# Altium schematic sheet ZynqPower.SchDoc: =TITLE
size A3; DocumentNumber: 3; SheetNumber: 3; SheetTotal: 11
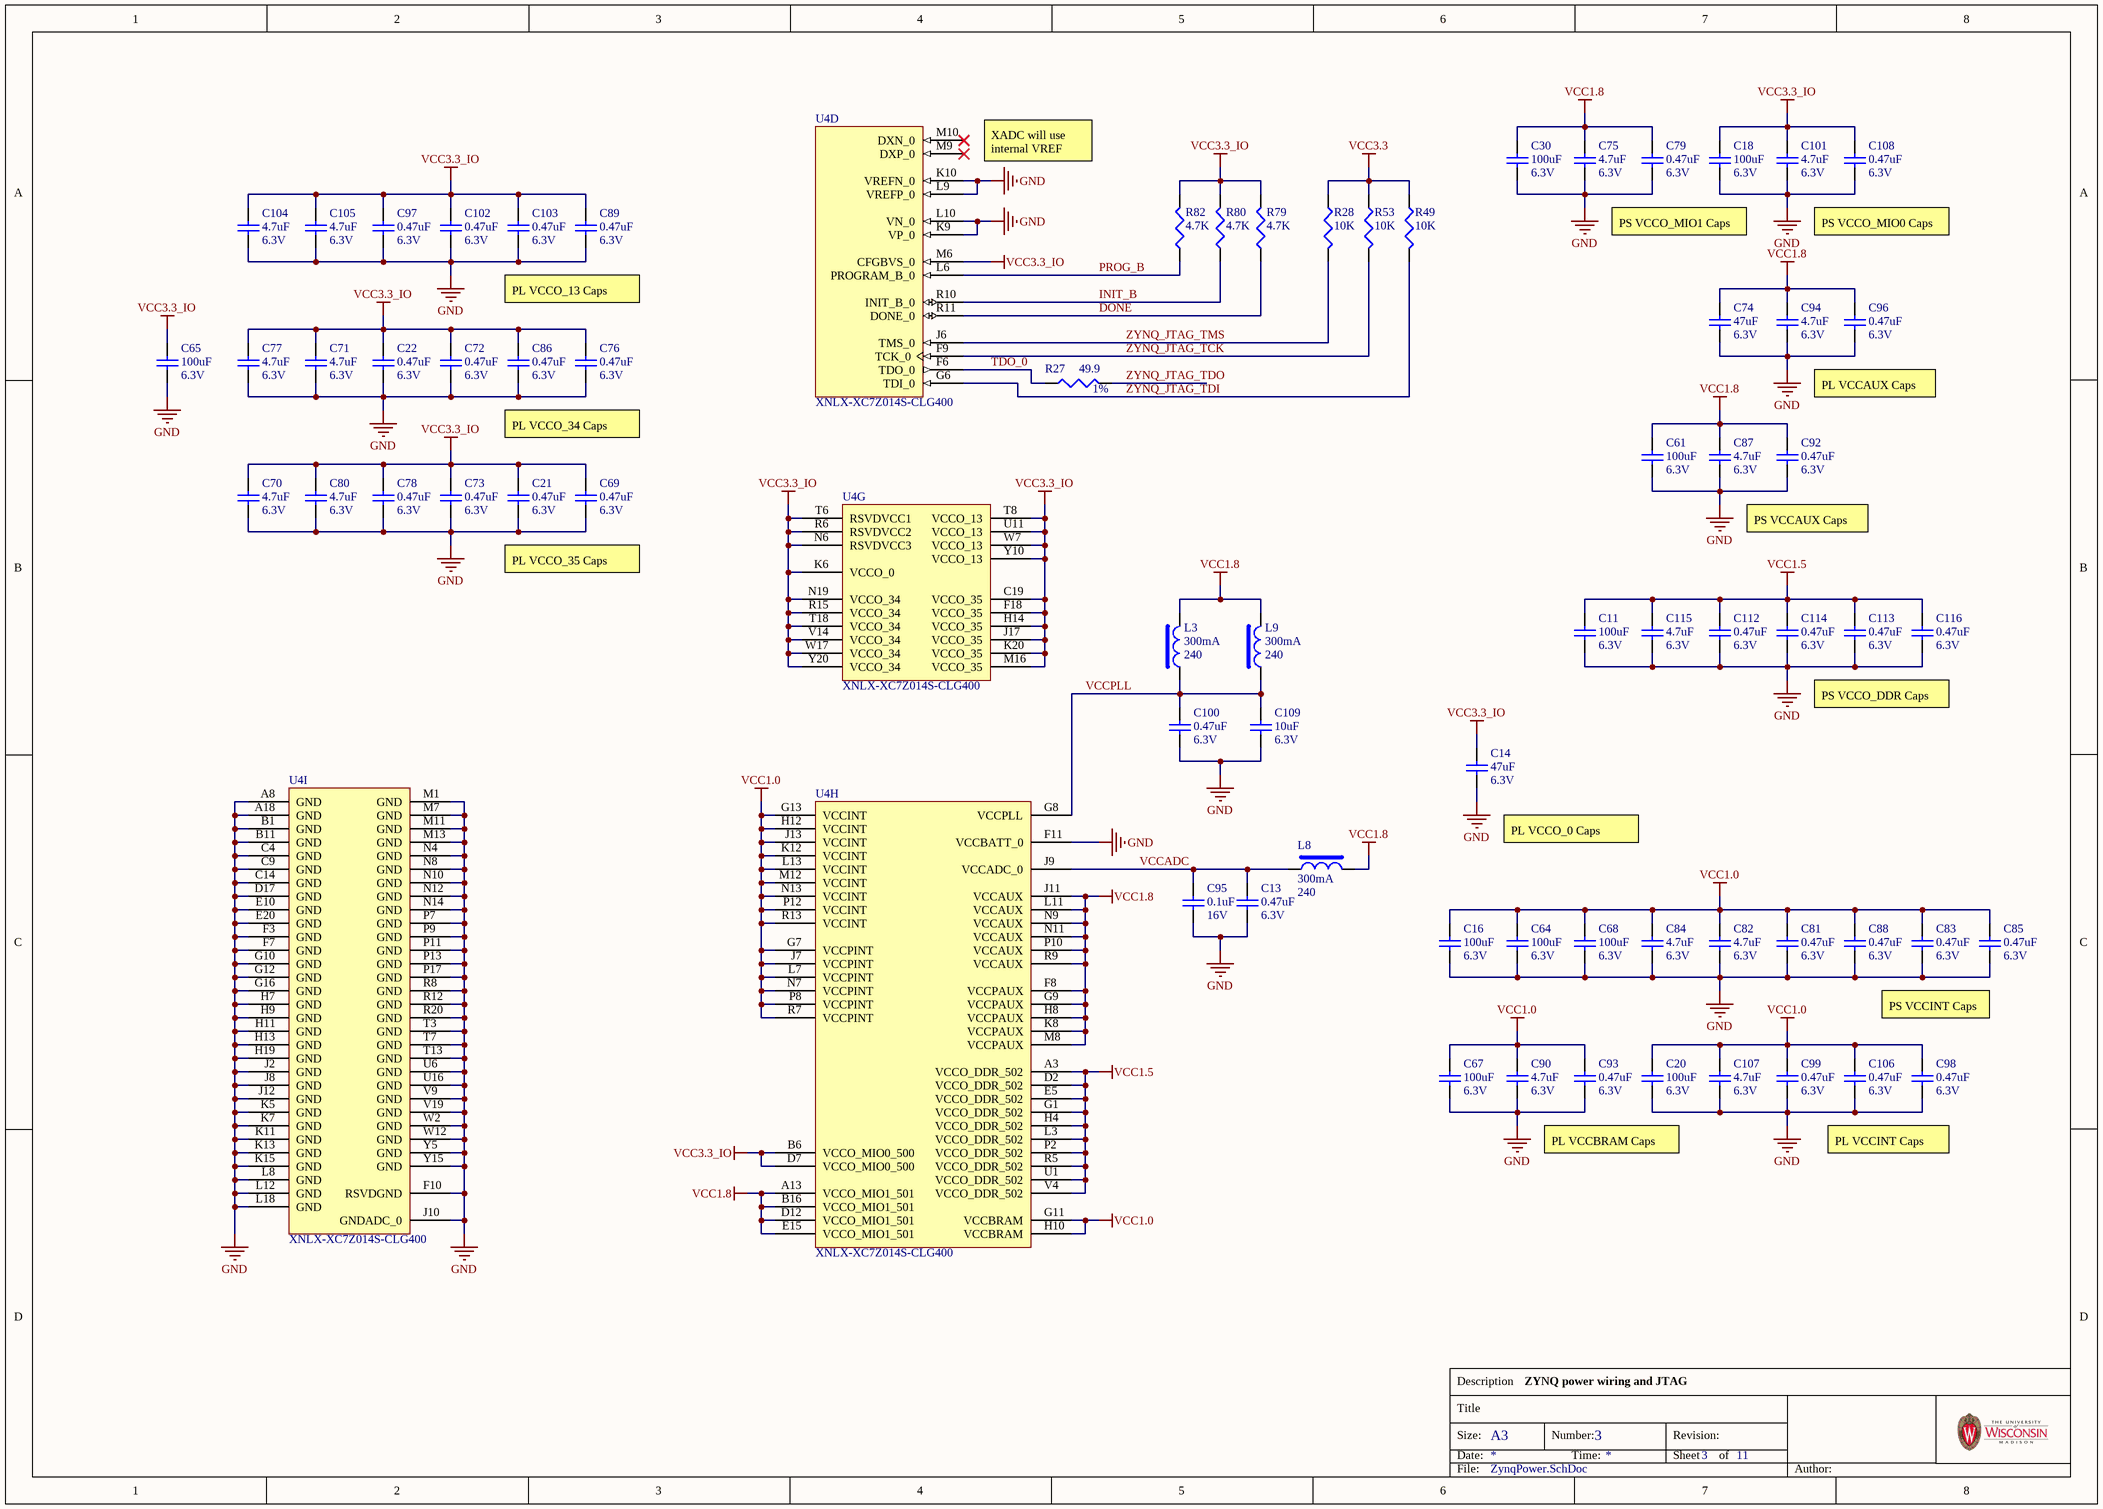
[diagram p0: ZynqPower.SchDoc]

## Parts
C11  value 100uF  Rating: 6.3V  [C1210_IPC_H]  (hidden comment: ?)
C13  value 0.47uF  Rating: 6.3V  [C0402_IPC_H]  (hidden comment: ?)
C14  value 47uF  Rating: 6.3V  [C0805_M]  (hidden comment: ?)
C16  value 100uF  Rating: 6.3V  [C1210_IPC_H]  (hidden comment: ?)
C18  value 100uF  Rating: 6.3V  [C1210_IPC_H]  (hidden comment: ?)
C20  value 100uF  Rating: 6.3V  [C1210_IPC_H]  (hidden comment: ?)
C21  value 0.47uF  Rating: 6.3V  [C0402_IPC_H]  (hidden comment: ?)
C22  value 0.47uF  Rating: 6.3V  [C0402_IPC_H]  (hidden comment: ?)
C30  value 100uF  Rating: 6.3V  [C1210_IPC_H]  (hidden comment: ?)
C61  value 100uF  Rating: 6.3V  [C1210_IPC_H]  (hidden comment: ?)
C64  value 100uF  Rating: 6.3V  [C1210_IPC_H]  (hidden comment: ?)
C65  value 100uF  Rating: 6.3V  [C1210_IPC_H]  (hidden comment: ?)
C67  value 100uF  Rating: 6.3V  [C1210_IPC_H]  (hidden comment: ?)
C68  value 100uF  Rating: 6.3V  [C1210_IPC_H]  (hidden comment: ?)
C69  value 0.47uF  Rating: 6.3V  [C0402_IPC_H]  (hidden comment: ?)
C70  value 4.7uF  Rating: 6.3V  [C0402_IPC_H]  (hidden comment: ?)
C71  value 4.7uF  Rating: 6.3V  [C0402_IPC_H]  (hidden comment: ?)
C72  value 0.47uF  Rating: 6.3V  [C0402_IPC_H]  (hidden comment: ?)
C73  value 0.47uF  Rating: 6.3V  [C0402_IPC_H]  (hidden comment: ?)
C74  value 47uF  Rating: 6.3V  [C0805_M]  (hidden comment: ?)
C75  value 4.7uF  Rating: 6.3V  [C0402_IPC_H]  (hidden comment: ?)
C76  value 0.47uF  Rating: 6.3V  [C0402_IPC_H]  (hidden comment: ?)
C77  value 4.7uF  Rating: 6.3V  [C0402_IPC_H]  (hidden comment: ?)
C78  value 0.47uF  Rating: 6.3V  [C0402_IPC_H]  (hidden comment: ?)
C79  value 0.47uF  Rating: 6.3V  [C0402_IPC_H]  (hidden comment: ?)
C80  value 4.7uF  Rating: 6.3V  [C0402_IPC_H]  (hidden comment: ?)
C81  value 0.47uF  Rating: 6.3V  [C0402_IPC_H]  (hidden comment: ?)
C82  value 4.7uF  Rating: 6.3V  [C0402_IPC_H]  (hidden comment: ?)
C83  value 0.47uF  Rating: 6.3V  [C0402_IPC_H]  (hidden comment: ?)
C84  value 4.7uF  Rating: 6.3V  [C0402_IPC_H]  (hidden comment: ?)
C85  value 0.47uF  Rating: 6.3V  [C0402_IPC_H]  (hidden comment: ?)
C86  value 0.47uF  Rating: 6.3V  [C0402_IPC_H]  (hidden comment: ?)
C87  value 4.7uF  Rating: 6.3V  [C0402_IPC_H]  (hidden comment: ?)
C88  value 0.47uF  Rating: 6.3V  [C0402_IPC_H]  (hidden comment: ?)
C89  value 0.47uF  Rating: 6.3V  [C0402_IPC_H]  (hidden comment: ?)
C90  value 4.7uF  Rating: 6.3V  [C0402_IPC_H]  (hidden comment: ?)
C92  value 0.47uF  Rating: 6.3V  [C0402_IPC_H]  (hidden comment: ?)
C93  value 0.47uF  Rating: 6.3V  [C0402_IPC_H]  (hidden comment: ?)
C94  value 4.7uF  Rating: 6.3V  [C0402_IPC_H]  (hidden comment: ?)
C95  value 0.1uF  Rating: 16V  [C0402_IPC_H]  (hidden comment: ?)
C96  value 0.47uF  Rating: 6.3V  [C0402_IPC_H]  (hidden comment: ?)
C97  value 0.47uF  Rating: 6.3V  [C0402_IPC_H]  (hidden comment: ?)
C98  value 0.47uF  Rating: 6.3V  [C0402_IPC_H]  (hidden comment: ?)
C99  value 0.47uF  Rating: 6.3V  [C0402_IPC_H]  (hidden comment: ?)
C100  value 0.47uF  Rating: 6.3V  [C0402_IPC_H]  (hidden comment: ?)
C101  value 4.7uF  Rating: 6.3V  [C0402_IPC_H]  (hidden comment: ?)
C102  value 0.47uF  Rating: 6.3V  [C0402_IPC_H]  (hidden comment: ?)
C103  value 0.47uF  Rating: 6.3V  [C0402_IPC_H]  (hidden comment: ?)
C104  value 4.7uF  Rating: 6.3V  [C0402_IPC_H]  (hidden comment: ?)
C105  value 4.7uF  Rating: 6.3V  [C0402_IPC_H]  (hidden comment: ?)
C106  value 0.47uF  Rating: 6.3V  [C0402_IPC_H]  (hidden comment: ?)
C107  value 4.7uF  Rating: 6.3V  [C0402_IPC_H]  (hidden comment: ?)
C108  value 0.47uF  Rating: 6.3V  [C0402_IPC_H]  (hidden comment: ?)
C109  value 10uF  Rating: 6.3V  [C0402_IPC_H]  (hidden comment: ?)
C112  value 0.47uF  Rating: 6.3V  [C0402_IPC_H]  (hidden comment: ?)
C113  value 0.47uF  Rating: 6.3V  [C0402_IPC_H]  (hidden comment: ?)
C114  value 0.47uF  Rating: 6.3V  [C0402_IPC_H]  (hidden comment: ?)
C115  value 4.7uF  Rating: 6.3V  [C0402_IPC_H]  (hidden comment: ?)
C116  value 0.47uF  Rating: 6.3V  [C0402_IPC_H]  (hidden comment: ?)
L3  value 240  Rated Current: 300mA  [L0402_H]  (hidden comment: BK1005HM241-T)
L8  value 240  Rated Current: 300mA  [L0402_H]  (hidden comment: BK1005HM241-T)
L9  value 240  Rated Current: 300mA  [L0402_H]  (hidden comment: BK1005HM241-T)
R27  value 49.9  Tolerance: 1%  [R0402_IPC_H]  (hidden comment: ?)
R28  value 10K  [R0402_IPC_H]  (hidden comment: ?)
R49  value 10K  [R0402_IPC_H]  (hidden comment: ?)
R53  value 10K  [R0402_IPC_H]  (hidden comment: ?)
R79  value 4.7K  [R0402_IPC_H]  (hidden comment: ?)
R80  value 4.7K  [R0402_IPC_H]  (hidden comment: ?)
R82  value 4.7K  [R0402_IPC_H]  (hidden comment: ?)
U4  XNLX-XC7Z014S-CLG400  [CLG400]  (parts D,G,H,I of 9)

## Nets
GND: C11.2 C13.2 C14.2 C16.2 C18.2 C20.2 C21.2 C22.2 C30.2 C61.2 C64.2 C65.2 C67.2 C68.2 C69.2 C70.2 C71.2 C72.2 C73.2 C74.2 C75.2 C76.2 C77.2 C78.2 C79.2 C80.2 C81.2 C82.2 C83.2 C84.2 C85.2 C86.2 C87.2 C88.2 C89.2 C90.2 C92.2 C93.2 C94.2 C95.2 C96.2 C97.2 C98.2 C99.2 C100.2 C101.2 C102.2 C103.2 C104.2 C105.2 C106.2 C107.2 C108.2 C109.2 C112.2 C113.2 C114.2 C115.2 C116.2 U4.A8(GND) U4.A18(GND) U4.B1(GND) U4.B11(GND) U4.C4(GND) U4.C9(GND) U4.C14(GND) U4.D17(GND) U4.E10(GND) U4.E20(GND) U4.F3(GND) U4.F7(GND) U4.F10(RSVDGND) U4.F11(VCCBATT_0) U4.G10(GND) U4.G12(GND) U4.G16(GND) U4.H7(GND) U4.H9(GND) U4.H11(GND) U4.H13(GND) U4.H19(GND) U4.J2(GND) U4.J8(GND) U4.J10(GNDADC_0) U4.J12(GND) U4.K5(GND) U4.K7(GND) U4.K9(VP_0) U4.K10(VREFN_0) U4.K11(GND) U4.K13(GND) U4.K15(GND) U4.L8(GND) U4.L9(VREFP_0) U4.L10(VN_0) U4.L12(GND) U4.L18(GND) U4.M1(GND) U4.M7(GND) U4.M11(GND) U4.M13(GND) U4.N4(GND) U4.N8(GND) U4.N10(GND) U4.N12(GND) U4.N14(GND) U4.P7(GND) U4.P9(GND) U4.P11(GND) U4.P13(GND) U4.P17(GND) U4.R8(GND) U4.R12(GND) U4.R20(GND) U4.T3(GND) U4.T7(GND) U4.T13(GND) U4.U6(GND) U4.U16(GND) U4.V9(GND) U4.V19(GND) U4.W2(GND) U4.W12(GND) U4.Y5(GND) U4.Y15(GND)
VCC1.0: C16.1 C20.1 C64.1 C67.1 C68.1 C81.1 C82.1 C83.1 C84.1 C85.1 C88.1 C90.1 C93.1 C98.1 C99.1 C106.1 C107.1 U4.G7(VCCPINT) U4.G11(VCCBRAM) U4.G13(VCCINT) U4.H10(VCCBRAM) U4.H12(VCCINT) U4.J7(VCCPINT) U4.J13(VCCINT) U4.K12(VCCINT) U4.L7(VCCPINT) U4.L13(VCCINT) U4.M12(VCCINT) U4.N7(VCCPINT) U4.N13(VCCINT) U4.P8(VCCPINT) U4.P12(VCCINT) U4.R7(VCCPINT) U4.R13(VCCINT)
VCC1.5: C11.1 C112.1 C113.1 C114.1 C115.1 C116.1 U4.A3(VCCO_DDR_502) U4.D2(VCCO_DDR_502) U4.E5(VCCO_DDR_502) U4.G1(VCCO_DDR_502) U4.H4(VCCO_DDR_502) U4.L3(VCCO_DDR_502) U4.P2(VCCO_DDR_502) U4.R5(VCCO_DDR_502) U4.U1(VCCO_DDR_502) U4.V4(VCCO_DDR_502)
VCC1.8: C30.1 C61.1 C74.1 C75.1 C79.1 C87.1 C92.1 C94.1 C96.1 L3.2 L8.2 L9.2 U4.A13(VCCO_MIO1_501) U4.B16(VCCO_MIO1_501) U4.D12(VCCO_MIO1_501) U4.E15(VCCO_MIO1_501) U4.F8(VCCPAUX) U4.G9(VCCPAUX) U4.H8(VCCPAUX) U4.J11(VCCAUX) U4.K8(VCCPAUX) U4.L11(VCCAUX) U4.M8(VCCPAUX) U4.N9(VCCAUX) U4.N11(VCCAUX) U4.P10(VCCAUX) U4.R9(VCCAUX)
VCC3.3: R28.1 R49.1 R53.1
VCC3.3_IO: C14.1 C18.1 C21.1 C22.1 C65.1 C69.1 C70.1 C71.1 C72.1 C73.1 C76.1 C77.1 C78.1 C80.1 C86.1 C89.1 C97.1 C101.1 C102.1 C103.1 C104.1 C105.1 C108.1 R79.2 R80.2 R82.2 U4.B6(VCCO_MIO0_500) U4.C19(VCCO_35) U4.D7(VCCO_MIO0_500) U4.F18(VCCO_35) U4.H14(VCCO_35) U4.J17(VCCO_35) U4.K6(VCCO_0) U4.K20(VCCO_35) U4.M6(CFGBVS_0) U4.M16(VCCO_35) U4.N6(RSVDVCC3) U4.N19(VCCO_34) U4.R6(RSVDVCC2) U4.R15(VCCO_34) U4.T6(RSVDVCC1) U4.T8(VCCO_13) U4.T18(VCCO_34) U4.U11(VCCO_13) U4.V14(VCCO_34) U4.W7(VCCO_13) U4.W17(VCCO_34) U4.Y10(VCCO_13) U4.Y20(VCCO_34)
DONE: R79.1 U4.R11(DONE_0)
INIT_B: R80.1 U4.R10(INIT_B_0)
PROG_B: R82.1 U4.L6(PROGRAM_B_0)
TDO_0: R27.2 U4.F6(TDO_0)
VCCADC: C13.1 C95.1 L8.1 U4.J9(VCCADC_0)
VCCPLL: C100.1 C109.1 L3.1 L9.1 U4.G8(VCCPLL)
ZYNQ_JTAG_TCK: R53.2 U4.F9(TCK_0)
ZYNQ_JTAG_TDI: R49.2 U4.G6(TDI_0)
ZYNQ_JTAG_TDO: R27.1
ZYNQ_JTAG_TMS: R28.2 U4.J6(TMS_0)

Not connected (* = marked no-connect by the designer): U4 M9(DXP_0)* M10(DXN_0)*

## Notes on the sheet
- XADC will use internal VREF
- PS VCCO_MIO1 Caps
- PS VCCO_MIO0 Caps
- PL VCCO_13 Caps
- PL VCCO_34 Caps
- PL VCCAUX Caps
- PL VCCO_35 Caps
- PS VCCAUX Caps
- PS VCCO_DDR Caps
- (near C14) PL VCCO_0 Caps
- PS VCCINT Caps
- PL VCCBRAM Caps
- PL VCCINT Caps
- ZYNQ power wiring and JTAG
- Description
- Title
- Size:
- Date:
- A3
- Number:
- Time:
- Revision:
- Sheet
- of
- File:
- Author:

## Library data of the parts
C11 C16 C18 C20 C30 C61 C64 C65 C67 C68 = Cap: Capacitor; Part: GRM32ER60J107ME20L; Manufacturer: Murata; INVKEY: CP1210-100UF-6.3V-20%; PackageDescription: Chip Capacitor
C13 C21 C22 C69 C72 C73 C76 C78 C79 C81 C83 C85 C86 C88 C89 C92 C93 C96-C100 C102 C103 C106 C108 C112-C114 C116 = Cap: Capacitor; Manufacturer: Murata; Part: GRM155R60J474KE19D; INVKEY: CP0402-0.47UF-6V3-10%; PackageDescription: Chip Capacitor
C14 C74 = Cap: Capacitor; Manufacturer: TDK; Part: C2012X5R0J476M125AC; INVKEY: CP0805-47UF-6.3V; PackageDescription: Chip Capacitor
C70 C71 C75 C77 C80 C82 C84 C87 C90 C94 C101 C104 C105 C107 C115 = Cap: Capacitor; Manufacturer: TDK; Part: C1005X5R0J475M050BC; INVKEY: CP0402-4.7UF-6.3V; PackageDescription: Chip Capacitor
C95 = Cap: Capacitor; Manufacturer: Murata; Part: GRM155R71C104KA88D; INVKEY: CP0402-0.1UF-16V-10%; PackageDescription: Chip Capacitor
C109 = Cap: Capacitor; Manufacturer: Murata; Part: GRM155R60J106ME44D; INVKEY: CP0402-10UF-6V3-20%; PackageDescription: Chip Capacitor
L3 L8 L9 = Bead: Bead Inductor; Manufacturer: Taiyo Yuden; Measuring Frequency: 100MHz; INVKEY: FB-BK1005HM241-T; PackageDescription: Chip Inductor; Part: BK1005HM241-T
R27 = Res: Resistor; Manufacturer: Panasonic; Part: ERJ-2RKF49R9X; INVKEY: RS0402-49R9-1/10W-1%; PackageDescription: Chip Resistor
R28 R49 R53 = Res: Resistor; Manufacturer: Panasonic-ECG; Part: ERJ-2GEJ103X; Tolerance: 5%; INVKEY: RS0402-10K-1/10W-5%; PackageDescription: Chip Resistor
R79 R80 R82 = Res: Resistor; Manufacturer: Panasonic; Part: ERJ-2RKF4701X; Tolerance: 1%; INVKEY: RS0402-4K7-1/10W-1%; PackageDescription: Chip Resistor
U4 = XNLX-XC7Z020-CLG400: Manufacturer: Xilinx; Part: XC7Z014S-1CLG400C; INVKEY: ?